# Altium schematic sheet SD Card Multiplexer.SchDoc: SD Card & SPI Select Switch
size 292 x 193 mm; DocumentNumber: 24; SheetNumber: 27; SheetTotal: 28
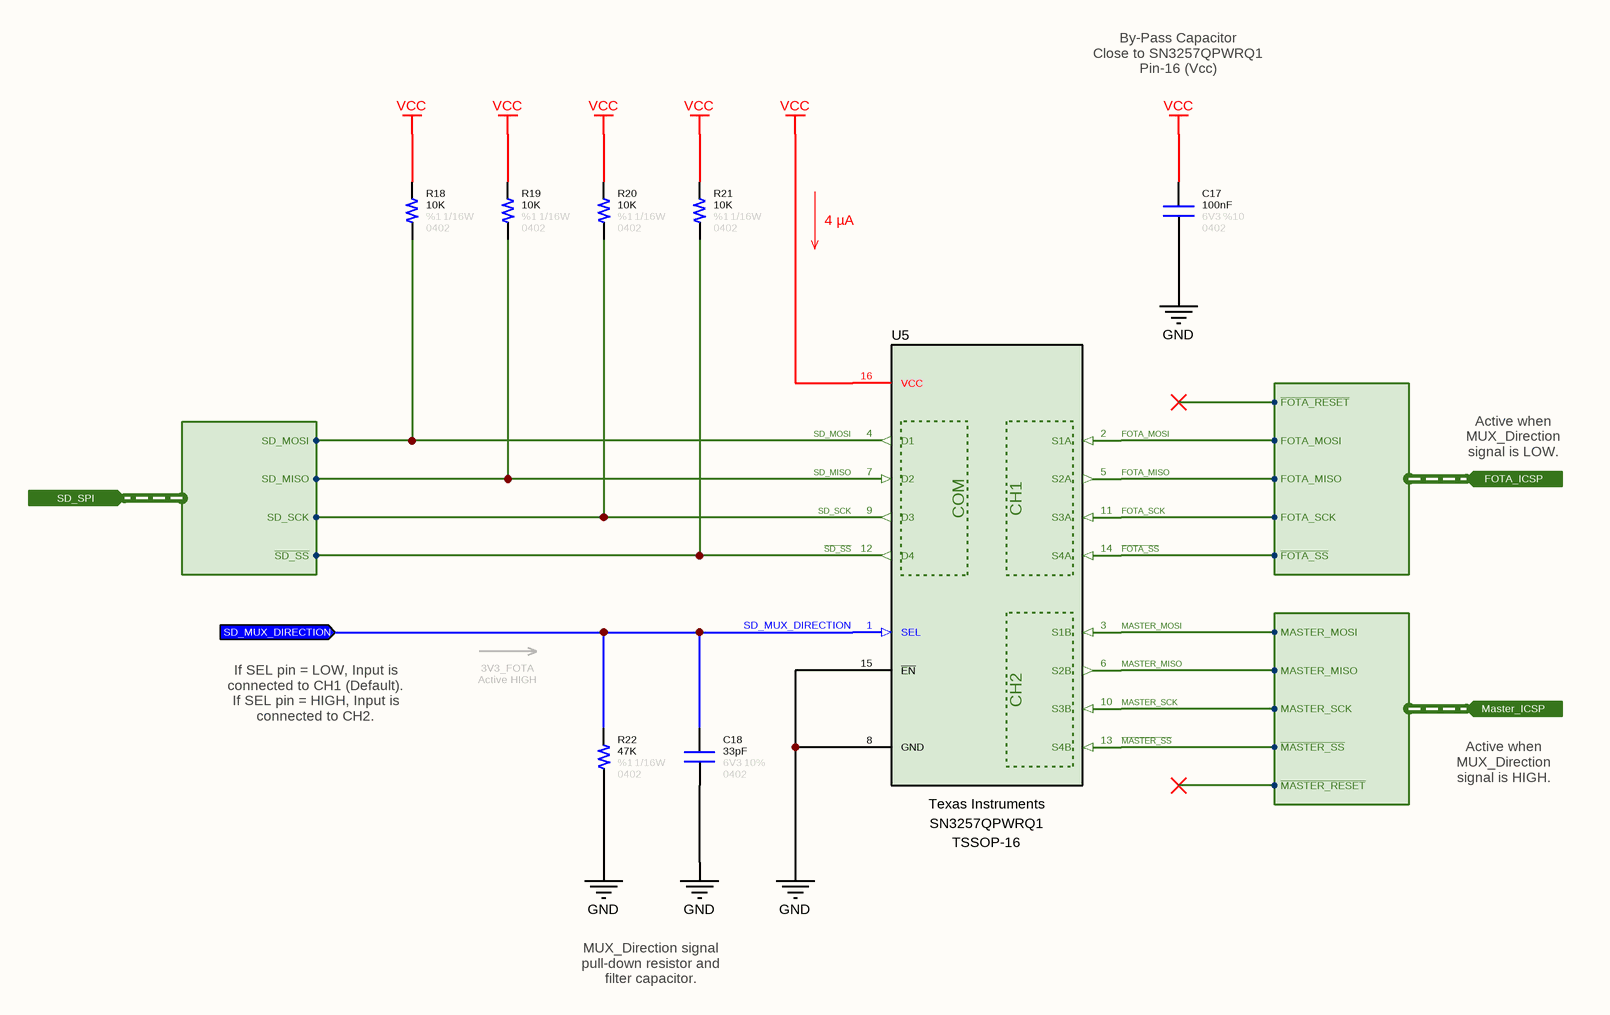
[diagram p0: SD Card Multiplexer.SchDoc]

## Parts
C17  value 100nF  Tolerance: %10  Voltage: 6V3  Case: 0402  [CAPACITOR_0402]  (hidden comment: Capacitor - 100nF [0402] (Ceramic))
C18  value 33pF  Tolerance: 10%  Case: 0402  Voltage: 6V3  [CAPACITOR_0402]  (hidden comment: Capacitor - 33pF [0402] (Ceramic))
R18  value 10K  Tolerance: %1  Case: 0402  Power: 1/16W  [RESISTOR_0402]  (hidden comment: 10K - 0402 - %1 - 1/16W)
R19  value 10K  Tolerance: %1  Case: 0402  Power: 1/16W  [RESISTOR_0402]  (hidden comment: 10K - 0402 - %1 - 1/16W)
R20  value 10K  Tolerance: %1  Case: 0402  Power: 1/16W  [RESISTOR_0402]  (hidden comment: 10K - 0402 - %1 - 1/16W)
R21  value 10K  Tolerance: %1  Case: 0402  Power: 1/16W  [RESISTOR_0402]  (hidden comment: 10K - 0402 - %1 - 1/16W)
R22  value 47K  Tolerance: %1  Case: 0402  Power: 1/16W  [RESISTOR_0402]  (hidden comment: 47K - 0402 - %1 - 1/16W)
U5  Manufacturer Name: Texas Instruments  [TSSOP-16]  (hidden comment: SN3257QPWRQ1)

## Ports
FOTA_ICSP (in, harness FOTA_ICSP), Master_ICSP (in, harness Master_ICSP), SD_MUX_DIRECTION (in), SD_SPI (in, harness SD_SPI)

## Harnesses
FOTA_ICSP: ~{FOTA_SS}, FOTA_MOSI, FOTA_MISO, FOTA_SCK, ~{FOTA_RESET}
Master_ICSP: MASTER_MOSI, MASTER_MISO, MASTER_SCK, ~{MASTER_RESET}, ~{MASTER_SS}
SD_SPI: SD_MOSI, ~{SD_SS}, SD_SCK, SD_MISO

## Nets
GND: C17.1 C18.1 R22.1 U5.8(GND) U5.15(~{EN})
VCC: C17.2 R18.2 R19.2 R20.2 R21.2 U5.16(VCC)
~{FOTA_SS}: U5.14(S4A) ; port FOTA_ICSP.~{FOTA_SS}
FOTA_MISO: U5.5(S2A) ; port FOTA_ICSP.FOTA_MISO
FOTA_MOSI: U5.2(S1A) ; port FOTA_ICSP.FOTA_MOSI
FOTA_SCK: U5.11(S3A) ; port FOTA_ICSP.FOTA_SCK
~{MASTER_SS}: U5.13(S4B) ; port Master_ICSP.~{MASTER_SS}
MASTER_MISO: U5.6(S2B) ; port Master_ICSP.MASTER_MISO
MASTER_MOSI: U5.3(S1B) ; port Master_ICSP.MASTER_MOSI
MASTER_SCK: U5.10(S3B) ; port Master_ICSP.MASTER_SCK
~{SD_SS}: R21.1 U5.12(D4) ; port SD_SPI.~{SD_SS}
SD_MISO: R19.1 U5.7(D2) ; port SD_SPI.SD_MISO
SD_MOSI: R18.1 U5.4(D1) ; port SD_SPI.SD_MOSI
SD_MUX_DIRECTION: C18.2 R22.2 U5.1(SEL) ; port SD_MUX_DIRECTION
SD_SCK: R20.1 U5.9(D3) ; port SD_SPI.SD_SCK

## Notes on the sheet
- By-Pass Capacitor
  Close to SN3257QPWRQ1
  Pin-16 (Vcc)
- 4 µA
- Active when MUX_Direction signal is LOW.
- If SEL pin = LOW, Input is connected to CH1 (Default).
  If SEL pin = HIGH, Input is connected to CH2.
- (near R22) 3V3_FOTA
  Active HIGH
- Active when MUX_Direction signal is HIGH.
- MUX_Direction signal pull-down resistor and filter capacitor.
- © 2021 All rights reserved.
  This document may not, in whole or in part, be copied, photocopied, reproduced, translated or converted to any electronic or machine readable from without prior written permission of Mehmet Günce Akkoyun.
  Engineer contact : akkoyun@me.com
- Property of
- Engineer :
- Date :
- Size :
- A4
- Time :
- Project :
- Page :
- /
- Customer :
- Product ID :
- Module ID :
- Version :
- File :
- Revision :
- (in symbol IC - SN3257) COM; CH1; CH2

## Library data of the parts
C17 = Capacitor - 100nF [0402-6V3]: Capacitor - 100nF [0402-6V3] (Ceramic); Manufacturer Name: AVX; Manufacturer Part Number: 04026D104KAT4A; ComponentLink1Description: Mouser; ComponentLink1URL: https://www.mouser.com.tr/ProductDetail/AVX/04026D104KAT4A?qs=sGAEpiMZZMs0AnBnWHyRQPg4iYkCw7IMED%2F4kpqgf7w%3D; ComponentLink2Description: DataSheet; ComponentLink2URL: https://www.mouser.com.tr/datasheet/2/40/cx5r-776519.pdf
C18 = Capacitor - 33pF [0402-6V3]: Manufacturer Name: Kemet; Manufacturer Part Number: C0402C330J9RACAUTO; ComponentLink1Description: DataSheet; ComponentLink1URL: https://api.kemet.com/component-edge/download/datasheet/C0402C330J9RACAUTO.pdf; ComponentLink2Description: Mouser; ComponentLink2URL: https://www.mouser.com/Search/Refine.aspx?Keyword=80-C0402C330J9RAUTO
R18-R21 = Resistor - 10K [0402]: Thick Film Resistors - SMD 1/16 W 10 KOhm 1%; Manufacturer Name: Vishay; Manufacturer Part Number: CRCW040210K0FKED; ComponentLink1Description: DataSheet; ComponentLink1URL: https://www.mouser.com.tr/datasheet/2/427/dcrcwe3-1762152.pdf; ComponentLink2Description: Mouser; ComponentLink2URL: https://www.mouser.com.tr/ProductDetail/Vishay-Dale/CRCW040210K0FKED?qs=sGAEpiMZZMu61qfTUdNhG2DpbjADlD3GcalbOv9utCY%3D
R22 = Resistor - 47K [0402]: Thick Film Resistors - SMD 1/16 W 47 KOhm 1%; Manufacturer Name: Vishay; Manufacturer Part Number: CRCW040247K0FKED; ComponentLink1Description: DataSheet; ComponentLink1URL: https://www.mouser.com.tr/datasheet/2/427/dcrcwe3-1762152.pdf; ComponentLink2Description: Mouser; ComponentLink2URL: https://www.mouser.com.tr/ProductDetail/Vishay-Dale/CRCW040247K0FKED?qs=sGAEpiMZZMu61qfTUdNhG2DpbjADlD3GL%252B3h1elTxqU%3D
U5 = IC - SN3257: Automotive 5-V, 2: 1 (SPDT), 4-channel switch with 1.8-V logic and powered-off protection 16-TSSOP -40 to 125; Supply Voltage - Max: 5.5 V; Supply Voltage - Min: 1.5 V; On Time - Max: 35 us, 60 us; Off Time - Max: 2.7 us, 95 ns; Supply Current - Max: 68 uA; Number of Channels: 4 Channel; On Resistance - Max: 5 Ohms; Product Type: Switch ICs; RoHS: Yes; Minimum Operating Temperature: - 40 C; Maximum Operating Temperature: + 125 C; Manufacturer Part Number: SN3257QPWRQ1; Case: TSSOP-16